# Altium schematic sheet DSP.SchDoc
size A4
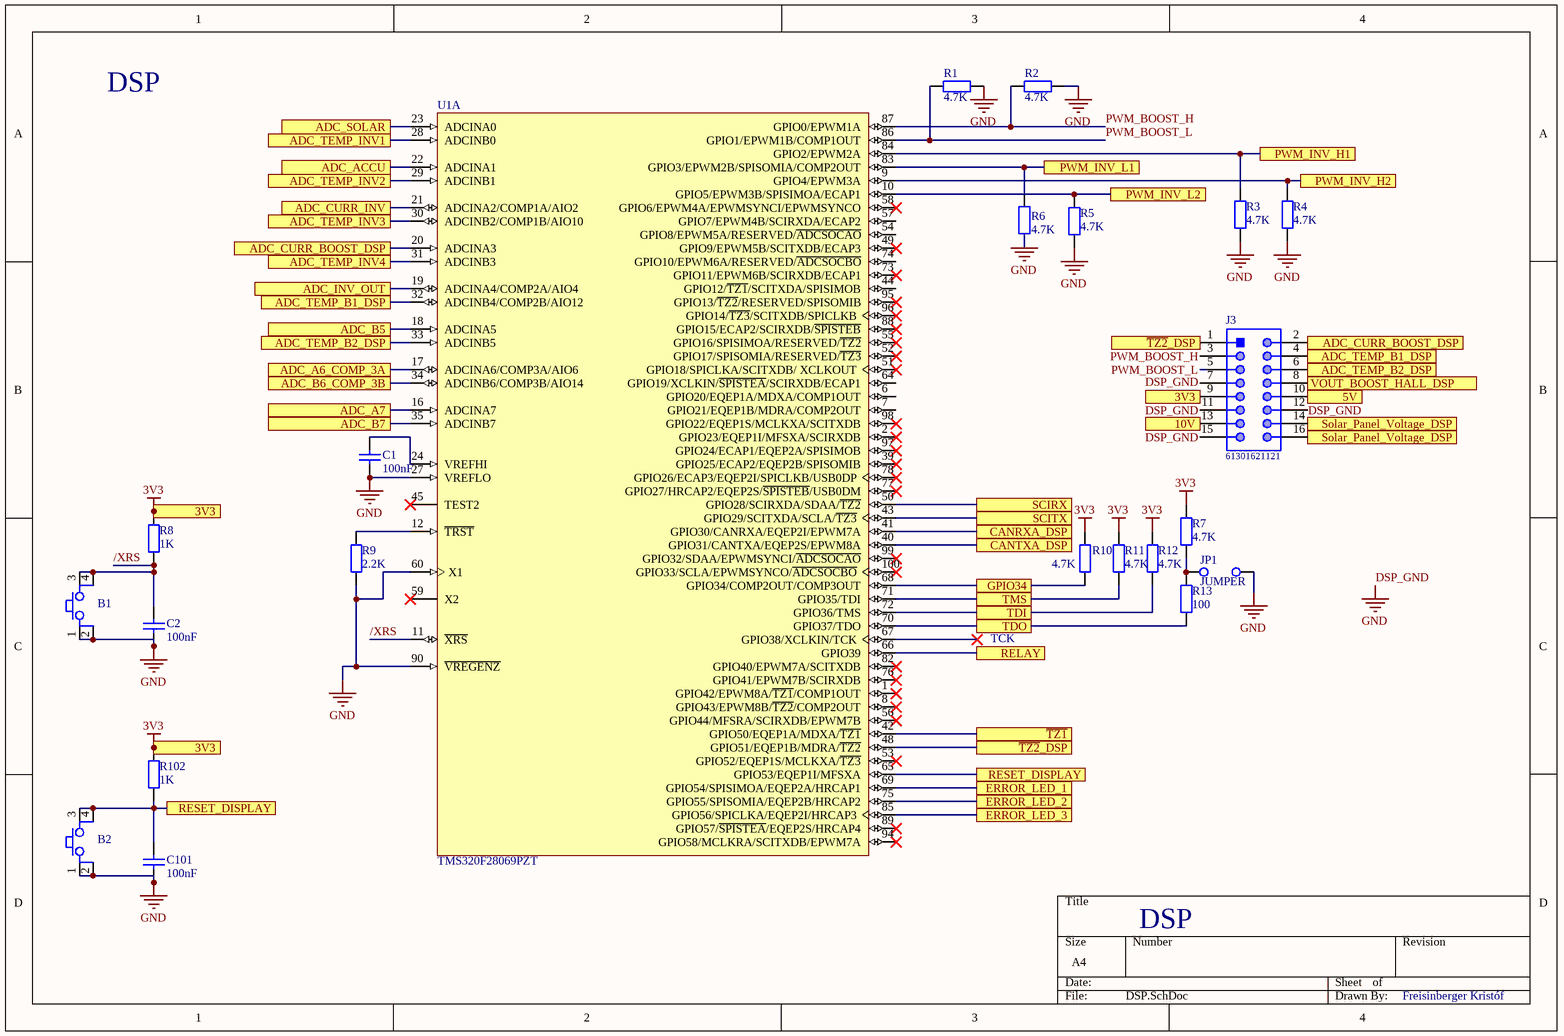
[diagram p0: DSP.SchDoc]

## Parts
B1  Button  [FP_BTN_SMD]  (value not drawn)
B2  Button  [FP_BTN_SMD]  (value not drawn)
C1  100nF  [FP_0805_CAP_085]
C2  100nF  [FP_0805_CAP_085]
C101  100nF  [FP_0805_CAP_085]
J3  61301621121  [61301621121]
JP1  JUMPER  [FP_CONN2_TUSKE_254MM]
R1  4.7K  [FP_0805_RES]
R2  4.7K  [FP_0805_RES]
R3  4.7K  [FP_0805_RES]
R4  4.7K  [FP_0805_RES]
R5  4.7K  [FP_0805_RES]
R6  4.7K  [FP_0805_RES]
R7  4.7K  [FP_0805_RES]
R8  1K  [FP_0805_RES]
R9  2.2K  [FP_0805_RES]
R10  4.7K  [FP_0805_RES]
R11  4.7K  [FP_0805_RES]
R12  4.7K  [FP_0805_RES]
R13  100  [FP_0805_RES]
R102  1K  [FP_0805_RES]
U1  TMS320F28069PZT  [PZ0100A_N]  (part A of 2)

## Ports
3V3, 5V, 10V, ADC_A6_COMP_3A, ADC_A7, ADC_ACCU, ADC_B5, ADC_B6_COMP_3B, ADC_B7, ADC_CURR_BOOST_DSP, ADC_CURR_INV, ADC_INV_OUT, ADC_SOLAR, ADC_TEMP_B1_DSP, ADC_TEMP_B2_DSP, ADC_TEMP_INV1, ADC_TEMP_INV2, ADC_TEMP_INV3, ADC_TEMP_INV4, CANRXA_DSP, CANTXA_DSP, ERROR_LED_1, ERROR_LED_2, ERROR_LED_3, GPIO34, PWM_INV_H1, PWM_INV_H2, PWM_INV_L1, PWM_INV_L2, RELAY, RESET_DISPLAY, SCIRX, SCITX, Solar_Panel_Voltage_DSP, TDI, TDO, TMS, VOUT_BOOST_HALL_DSP, ~{TZ1}, ~{TZ2}_DSP

## Nets
3V3: J3.9 R7.2 R8.2 R10.2 R11.2 R12.2 R102.2 ; port 3V3
DSP_GND: B1.1 B1.2 B2.1 B2.2 C1.1 C2.1 C101.1 J3.11 J3.12 J3.15 JP1.2(C2) R1.2 R2.1 R3.1 R4.1 R5.1 R6.1 R9.1 U1.27(VREFLO) U1.60(X1) U1.90(~{VREGENZ})  [also labelled GND]
5V: J3.10 ; port 5V
10V: J3.13 ; port 10V
/XRS: B1.3 B1.4 C2.2 R8.1 U1.11(~{XRS})
ADC_A6_COMP_3A: U1.17(ADCINA6/COMP3A/AIO6) ; port ADC_A6_COMP_3A
ADC_A7: U1.16(ADCINA7) ; port ADC_A7
ADC_ACCU: U1.22(ADCINA1) ; port ADC_ACCU
ADC_B5: U1.18(ADCINA5) ; port ADC_B5
ADC_B6_COMP_3B: U1.34(ADCINB6/COMP3B/AIO14) ; port ADC_B6_COMP_3B
ADC_B7: U1.35(ADCINB7) ; port ADC_B7
ADC_CURR_BOOST_DSP: J3.2 U1.20(ADCINA3) ; port ADC_CURR_BOOST_DSP
ADC_CURR_INV: U1.21(ADCINA2/COMP1A/AIO2) ; port ADC_CURR_INV
ADC_INV_OUT: U1.19(ADCINA4/COMP2A/AIO4) ; port ADC_INV_OUT
ADC_SOLAR: U1.23(ADCINA0) ; port ADC_SOLAR
ADC_TEMP_B1_DSP: J3.4 U1.32(ADCINB4/COMP2B/AIO12) ; port ADC_TEMP_B1_DSP
ADC_TEMP_B2_DSP: J3.6 U1.33(ADCINB5) ; port ADC_TEMP_B2_DSP
ADC_TEMP_INV1: U1.28(ADCINB0) ; port ADC_TEMP_INV1
ADC_TEMP_INV2: U1.29(ADCINB1) ; port ADC_TEMP_INV2
ADC_TEMP_INV3: U1.30(ADCINB2/COMP1B/AIO10) ; port ADC_TEMP_INV3
ADC_TEMP_INV4: U1.31(ADCINB3) ; port ADC_TEMP_INV4
CANRXA_DSP: U1.41(GPIO30/CANRXA/EQEP2I/EPWM7A) ; port CANRXA_DSP
CANTXA_DSP: U1.40(GPIO31/CANTXA/EQEP2S/EPWM8A) ; port CANTXA_DSP
ERROR_LED_1: U1.69(GPIO54/SPISIMOA/EQEP2A/HRCAP1) ; port ERROR_LED_1
ERROR_LED_2: U1.75(GPIO55/SPISOMIA/EQEP2B/HRCAP2) ; port ERROR_LED_2
ERROR_LED_3: U1.85(GPIO56/SPICLKA/EQEP2I/HRCAP3) ; port ERROR_LED_3
GPIO34: R10.1 U1.68(GPIO34/COMP2OUT/COMP3OUT) ; port GPIO34
PWM_BOOST_H: J3.3 R2.2 U1.87(GPIO0/EPWM1A)
PWM_BOOST_L: J3.5 R1.1 U1.86(GPIO1/EPWM1B/COMP1OUT)
PWM_INV_H1: R3.2 U1.84(GPIO2/EPWM2A) ; port PWM_INV_H1
PWM_INV_H2: R4.2 U1.9(GPIO4/EPWM3A) ; port PWM_INV_H2
PWM_INV_L1: R6.2 U1.83(GPIO3/EPWM2B/SPISOMIA/COMP2OUT) ; port PWM_INV_L1
PWM_INV_L2: R5.2 U1.10(GPIO5/EPWM3B/SPISIMOA/ECAP1) ; port PWM_INV_L2
RELAY: U1.66(GPIO39) ; port RELAY
RESET_DISPLAY: B2.3 B2.4 C101.2 R102.1 U1.65(GPIO53/EQEP1I/MFSXA) ; port RESET_DISPLAY
SCIRX: U1.50(GPIO28/SCIRXDA/SDAA/~{TZ2}) ; port SCIRX
SCITX: U1.43(GPIO29/SCITXDA/SCLA/~{TZ3}) ; port SCITX
Solar_Panel_Voltage_DSP: J3.14 J3.16 ; port Solar_Panel_Voltage_DSP
~{TZ1}: U1.42(GPIO50/EQEP1A/MDXA/~{TZ1}) ; port ~{TZ1}
~{TZ2}_DSP: J3.1 U1.48(GPIO51/EQEP1B/MDRA/~{TZ2}) ; port ~{TZ2}_DSP
TDI: R12.1 U1.72(GPIO36/TMS) ; port TDI
TDO: R13.1 U1.70(GPIO37/TDO) ; port TDO
TMS: R11.1 U1.71(GPIO35/TDI) ; port TMS
VOUT_BOOST_HALL_DSP: J3.8 ; port VOUT_BOOST_HALL_DSP
NetC1_2: C1.2 U1.24(VREFHI)
NetJP1_1: JP1.1(C1) R7.1 R13.2
NetR9_2: R9.2 U1.12(~{TRST})

Not connected (* = marked no-connect by the designer): J3 7; U1 1(GPIO42/EPWM8A/~{TZ1}/COMP1OUT)* 2(GPIO23/EQEP1I/MFSXA/SCIRXDB)* 6(GPIO20/EQEP1A/MDXA/COMP1OUT) 7(GPIO21/EQEP1B/MDRA/COMP2OUT) 8(GPIO43/EPWM8B/~{TZ2}/COMP2OUT)* 39(GPIO25/ECAP2/EQEP2B/SPISOMIB)* 44(GPIO12/~{TZ1}/SCITXDA/SPISIMOB) 45(TEST2)* 49(GPIO9/EPWM5B/SCITXDB/ECAP3)* 51(GPIO18/SPICLKA/SCITXDB/_XCLKOUT)* 52(GPIO17/SPISOMIA/RESERVED/~{TZ3})* 53(GPIO52/EQEP1S/MCLKXA/~{TZ3})* 54(GPIO8/EPWM5A/RESERVED/~{ADCSOCAO}) 55(GPIO16/SPISIMOA/RESERVED/~{TZ2})* 56(GPIO44/MFSRA/SCIRXDB/EPWM7B)* 57(GPIO7/EPWM4B/SCIRXDA/ECAP2) 58(GPIO6/EPWM4A/EPWMSYNCI/EPWMSYNCO)* 59(X2)* 64(GPIO19/XCLKIN/~{SPISTEA}/SCIRXDB/ECAP1) 67(GPIO38/XCLKIN/TCK)* 73(GPIO11/EPWM6B/SCIRXDB/ECAP1)* 74(GPIO10/EPWM6A/RESERVED/~{ADCSOCBO}) 76(GPIO41/EPWM7B/SCIRXDB)* 77(GPIO27/HRCAP2/EQEP2S/~{SPISTEB}/USB0DM)* 78(GPIO26/ECAP3/EQEP2I/SPICLKB/USB0DP)* 82(GPIO40/EPWM7A/SCITXDB)* 88(GPIO15/ECAP2/SCIRXDB/~{SPISTEB})* 89(GPIO57/~{SPISTEA}/EQEP2S/HRCAP4)* 94(GPIO58/MCLKRA/SCITXDB/EPWM7A)* 95(GPIO13/~{TZ2}/RESERVED/SPISOMIB)* 96(GPIO14/~{TZ3}/SCITXDB/SPICLKB)* 97(GPIO24/ECAP1/EQEP2A/SPISIMOB)* 98(GPIO22/EQEP1S/MCLKXA/SCITXDB)* 99(GPIO32/SDAA/EPWMSYNCI/~{ADCSOCAO})* 100(GPIO33/SCLA/EPWMSYNCO/~{ADCSOCBO})*

## Notes on the sheet
- DSP
- TCK
- Freisinberger Kristóf
- Labels drawn without touching a wire or pin: DSP_GND

## Library data of the parts
B1 B2 = Button 4P: Push button
C1 C2 C101 = CAP: Capacitor; Value: 100nF
J3 = CMP-1502-01097-1: THT Vertical Pin Header WR-PHD, Pitch 2.54 mm, Dual Row, 16 pins; Manufacturer: Wurth Elektronik; Gender: Male; Rated Current: 3A; Pitch: 2.54mm; Withstanding Voltage: 500VAC; Contact Resistance: 20mOhm; Working Voltage: 250VAC; Pin Number: 16; Mounting Technology: THT; Orientation: Vertical; Manufacturer URL: http://www.we-online.de; Row Number: Dual; Part Number: 61301621121; Datasheet URL: https://katalog.we-online.de/em/datasheet/6130xx21121.pdf; Packaging: Bag; Operating Temperature: -40to105degC; Publisher: WurthElektronik; Package Reference: 61301621121
JP1 = JUMPER: Jumper Wire
R1-R13 R102 = RES: Resistor
  R1-R7 R10-R12: Value: 4.7K
  R8 R102: Value: 1K
  R9: Value: 2.2K
  R13: Value: 100
U1 = DSP_100_CMP-0546-00052-3: Piccolo Microcontroller, High-Efficiency 32-Bit CPU, 100 KB, 90 MHz, FPU, VCU, 19 Ch PWM, 54 GPIO, 3.3 V, -40 to 105 degC, 100-Pin LQFP (PZ), Green (RoHS & no Sb/Br); Manufacturer: Texas Instruments; CAP/QEP: 7/2; Peak MMACS: 90; IO Supply (V): 3.3; 12-bit A/D (#Channels): 16; PWM (Ch): 19; CLA: 1; Timers: 3 32-Bit GP 1 WD; VCU: Yes; RAM (KB): 100; CPU: C28x; GPIO: 54; USB: 0; PackageVersion: 4040149/B; Operating Temperature Range (degC): -40 to 105; Mounting Technology: Surface Mount; ComponentLink2URL: http://www.ti.com/lit/ds/symlink/tms320f28069.pdf; DatasheetVersion: SPRS698D; PartNumber: TMS320F28069PZT; FPU: Yes; Frequency (MHz): 90; ComponentLink3Description: Package Specification; ComponentLink3URL: http://www.ti.com/lit/ds/symlink/tms320f28066.pdf; PackageDescription: 100-Pin Plastic Quad Flat Package, Body 14 x 14 mm, Pitch 0.5 mm; PackageReference: PZ0100A; ComponentLink1URL: http://www.ti.com/; ComponentLink2Description: Datasheet; ComponentLink1Description: Manufacturer URL; Eco Plan: Green (RoHS & no Sb/Br)